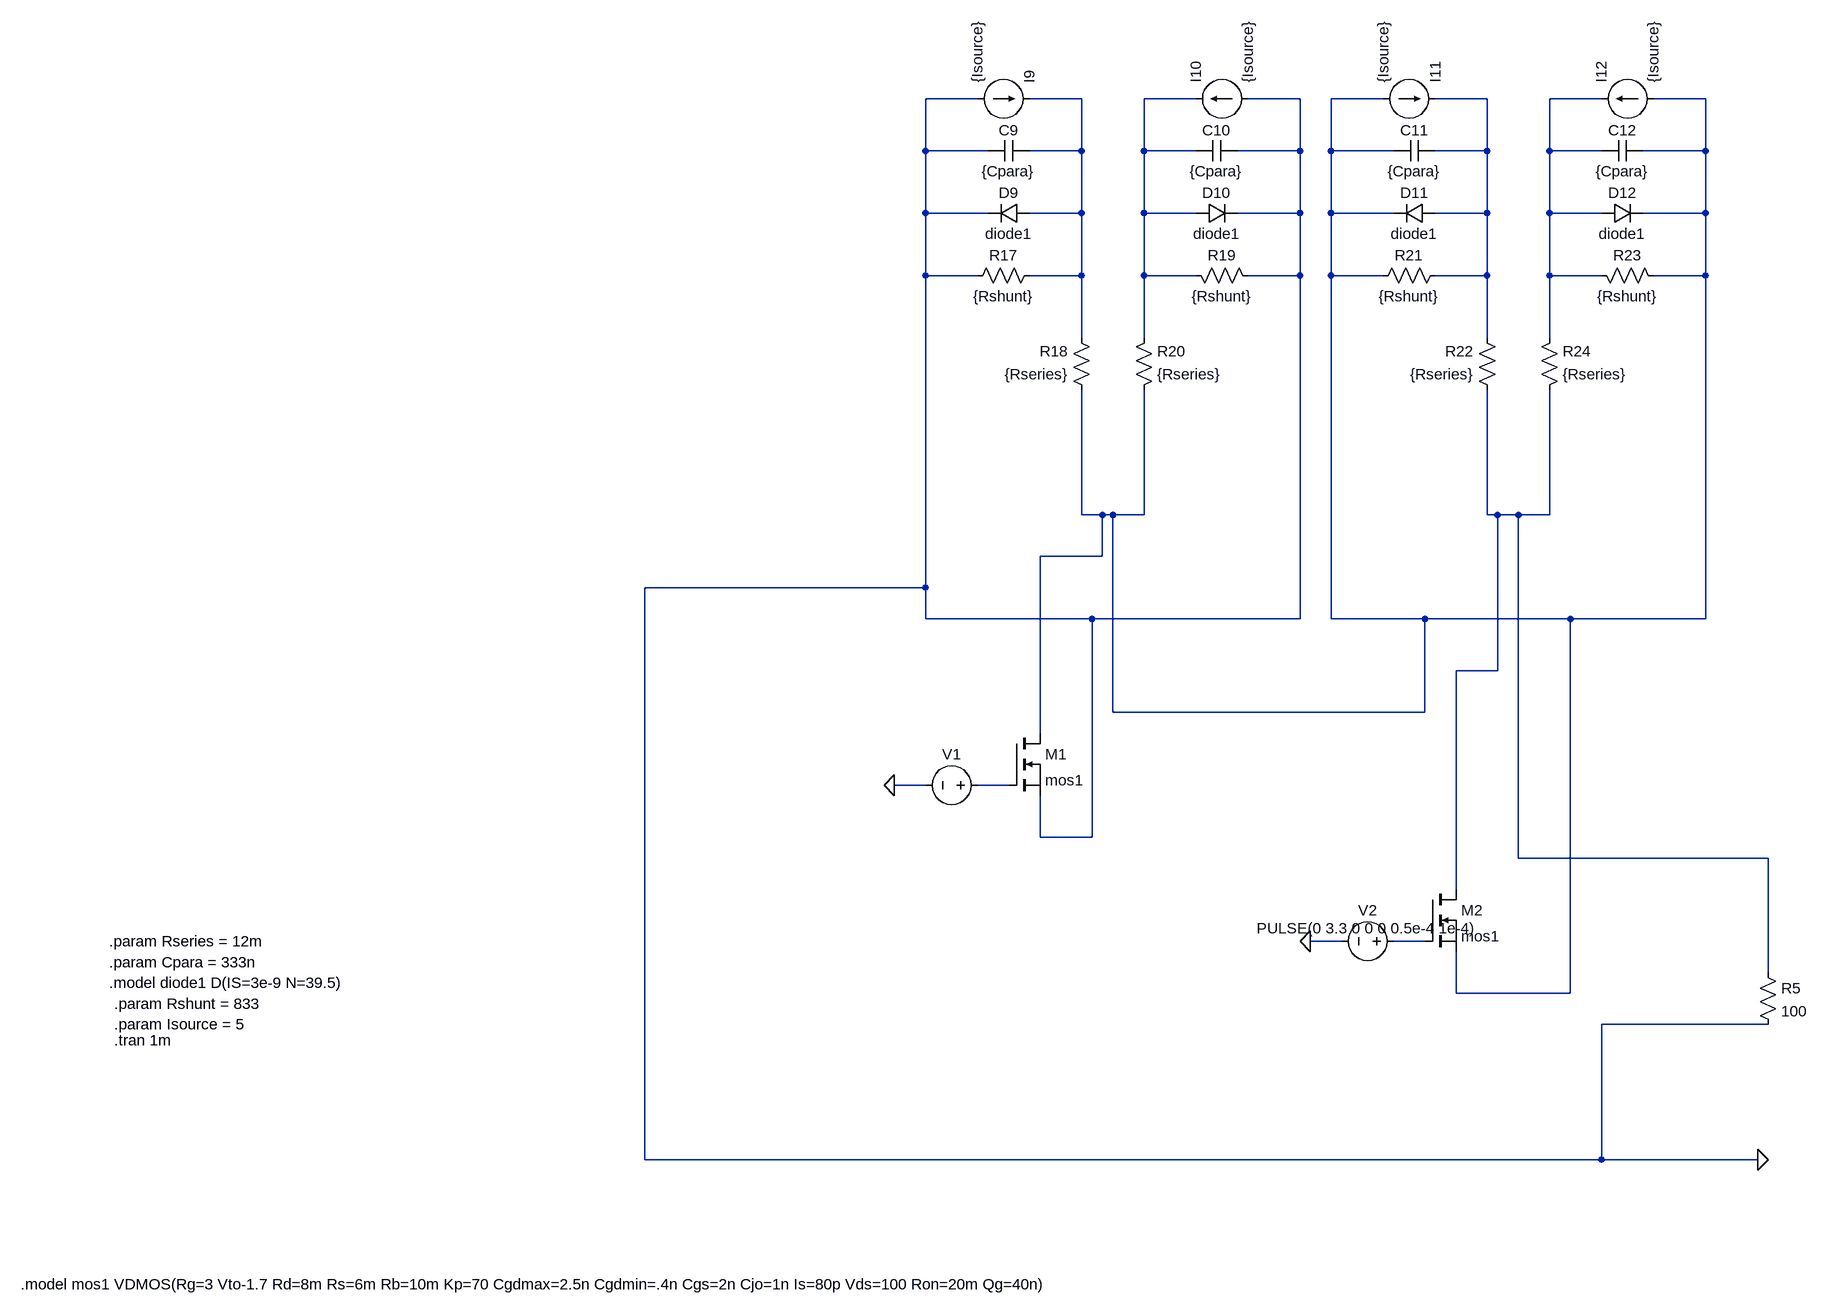
[diagram p0: schematic string-module-simple-36x2.asc]
string-module-simple-36x2.asc, the LTspice schematic file:
Version 4
SHEET 1 5004 680
WIRE 1184 -1504 1104 -1504
WIRE 1344 -1504 1264 -1504
WIRE 1520 -1504 1440 -1504
WIRE 1680 -1504 1600 -1504
WIRE 1808 -1504 1728 -1504
WIRE 1968 -1504 1888 -1504
WIRE 2144 -1504 2064 -1504
WIRE 2304 -1504 2224 -1504
WIRE 1104 -1424 1104 -1504
WIRE 1200 -1424 1104 -1424
WIRE 1344 -1424 1344 -1504
WIRE 1344 -1424 1264 -1424
WIRE 1440 -1424 1440 -1504
WIRE 1520 -1424 1440 -1424
WIRE 1680 -1424 1680 -1504
WIRE 1680 -1424 1584 -1424
WIRE 1728 -1424 1728 -1504
WIRE 1824 -1424 1728 -1424
WIRE 1968 -1424 1968 -1504
WIRE 1968 -1424 1888 -1424
WIRE 2064 -1424 2064 -1504
WIRE 2144 -1424 2064 -1424
WIRE 2304 -1424 2304 -1504
WIRE 2304 -1424 2208 -1424
WIRE 1104 -1328 1104 -1424
WIRE 1200 -1328 1104 -1328
WIRE 1344 -1328 1344 -1424
WIRE 1344 -1328 1264 -1328
WIRE 1440 -1328 1440 -1424
WIRE 1520 -1328 1440 -1328
WIRE 1680 -1328 1680 -1424
WIRE 1680 -1328 1584 -1328
WIRE 1728 -1328 1728 -1424
WIRE 1824 -1328 1728 -1328
WIRE 1968 -1328 1968 -1424
WIRE 1968 -1328 1888 -1328
WIRE 2064 -1328 2064 -1424
WIRE 2144 -1328 2064 -1328
WIRE 2304 -1328 2304 -1424
WIRE 2304 -1328 2208 -1328
WIRE 1104 -1232 1104 -1328
WIRE 1184 -1232 1104 -1232
WIRE 1344 -1232 1344 -1328
WIRE 1344 -1232 1264 -1232
WIRE 1440 -1232 1440 -1328
WIRE 1520 -1232 1440 -1232
WIRE 1680 -1232 1680 -1328
WIRE 1680 -1232 1600 -1232
WIRE 1728 -1232 1728 -1328
WIRE 1808 -1232 1728 -1232
WIRE 1968 -1232 1968 -1328
WIRE 1968 -1232 1888 -1232
WIRE 2064 -1232 2064 -1328
WIRE 2144 -1232 2064 -1232
WIRE 2304 -1232 2304 -1328
WIRE 2304 -1232 2224 -1232
WIRE 1344 -1136 1344 -1232
WIRE 1440 -1136 1440 -1232
WIRE 1968 -1136 1968 -1232
WIRE 2064 -1136 2064 -1232
WIRE 1344 -864 1344 -1056
WIRE 1376 -864 1344 -864
WIRE 1392 -864 1376 -864
WIRE 1440 -864 1440 -1056
WIRE 1440 -864 1392 -864
WIRE 1968 -864 1968 -1056
WIRE 1984 -864 1968 -864
WIRE 2016 -864 1984 -864
WIRE 2064 -864 2064 -1056
WIRE 2064 -864 2016 -864
WIRE 1376 -800 1376 -864
WIRE 1376 -800 1280 -800
WIRE 1104 -752 1104 -1232
WIRE 1104 -752 672 -752
WIRE 1104 -704 1104 -752
WIRE 1360 -704 1104 -704
WIRE 1680 -704 1680 -1232
WIRE 1680 -704 1360 -704
WIRE 1728 -704 1728 -1232
WIRE 1872 -704 1728 -704
WIRE 2096 -704 1872 -704
WIRE 2304 -704 2304 -1232
WIRE 2304 -704 2096 -704
WIRE 1984 -624 1984 -864
WIRE 1984 -624 1920 -624
WIRE 1392 -560 1392 -864
WIRE 1872 -560 1872 -704
WIRE 1872 -560 1392 -560
WIRE 1280 -528 1280 -800
WIRE 1104 -448 1056 -448
WIRE 1232 -448 1184 -448
WIRE 1280 -368 1280 -432
WIRE 1360 -368 1360 -704
WIRE 1360 -368 1280 -368
WIRE 2016 -336 2016 -864
WIRE 2400 -336 2016 -336
WIRE 1920 -288 1920 -624
WIRE 1744 -208 1696 -208
WIRE 1872 -208 1824 -208
WIRE 2400 -160 2400 -336
WIRE 1920 -128 1920 -192
WIRE 2096 -128 2096 -704
WIRE 2096 -128 1920 -128
WIRE 2400 -80 2144 -80
WIRE 672 128 672 -752
WIRE 2144 128 2144 -80
WIRE 2144 128 672 128
WIRE 2384 128 2144 128
FLAG 1056 -448 0
FLAG 2384 128 0
FLAG 1696 -208 0
SYMBOL current 1184 -1504 R270
WINDOW 0 24 80 Left 2
WINDOW 3 24 0 Left 2
WINDOW 123 0 0 Left 2
WINDOW 39 0 0 Left 2
SYMATTR InstName I9
SYMATTR Value {Isource}
SYMBOL cap 1264 -1440 R90
WINDOW 0 0 32 VBottom 2
WINDOW 3 32 32 VTop 2
SYMATTR InstName C9
SYMATTR Value {Cpara}
SYMBOL diode 1264 -1344 R90
WINDOW 0 0 32 VBottom 2
WINDOW 3 32 32 VTop 2
SYMATTR InstName D9
SYMATTR Value diode1
SYMBOL res 1280 -1248 R90
WINDOW 0 0 56 VBottom 2
WINDOW 3 32 56 VTop 2
SYMATTR InstName R17
SYMATTR Value {Rshunt}
SYMBOL res 1360 -1040 R180
WINDOW 0 36 76 Left 2
WINDOW 3 36 40 Left 2
SYMATTR InstName R18
SYMATTR Value {Rseries}
SYMBOL current 1600 -1504 M270
WINDOW 0 24 80 Left 2
WINDOW 3 24 0 Left 2
WINDOW 123 0 0 Left 2
WINDOW 39 0 0 Left 2
SYMATTR InstName I10
SYMATTR Value {Isource}
SYMBOL cap 1520 -1440 M90
WINDOW 0 0 32 VBottom 2
WINDOW 3 32 32 VTop 2
SYMATTR InstName C10
SYMATTR Value {Cpara}
SYMBOL diode 1520 -1344 M90
WINDOW 0 0 32 VBottom 2
WINDOW 3 32 32 VTop 2
SYMATTR InstName D10
SYMATTR Value diode1
SYMBOL res 1504 -1248 M90
WINDOW 0 0 56 VBottom 2
WINDOW 3 32 56 VTop 2
SYMATTR InstName R19
SYMATTR Value {Rshunt}
SYMBOL res 1424 -1040 M180
WINDOW 0 36 76 Left 2
WINDOW 3 36 40 Left 2
SYMATTR InstName R20
SYMATTR Value {Rseries}
SYMBOL current 1808 -1504 R270
WINDOW 0 24 80 Left 2
WINDOW 3 24 0 Left 2
WINDOW 123 0 0 Left 2
WINDOW 39 0 0 Left 2
SYMATTR InstName I11
SYMATTR Value {Isource}
SYMBOL cap 1888 -1440 R90
WINDOW 0 0 32 VBottom 2
WINDOW 3 32 32 VTop 2
SYMATTR InstName C11
SYMATTR Value {Cpara}
SYMBOL diode 1888 -1344 R90
WINDOW 0 0 32 VBottom 2
WINDOW 3 32 32 VTop 2
SYMATTR InstName D11
SYMATTR Value diode1
SYMBOL res 1904 -1248 R90
WINDOW 0 0 56 VBottom 2
WINDOW 3 32 56 VTop 2
SYMATTR InstName R21
SYMATTR Value {Rshunt}
SYMBOL res 1984 -1040 R180
WINDOW 0 36 76 Left 2
WINDOW 3 36 40 Left 2
SYMATTR InstName R22
SYMATTR Value {Rseries}
SYMBOL current 2224 -1504 M270
WINDOW 0 24 80 Left 2
WINDOW 3 24 0 Left 2
WINDOW 123 0 0 Left 2
WINDOW 39 0 0 Left 2
SYMATTR InstName I12
SYMATTR Value {Isource}
SYMBOL cap 2144 -1440 M90
WINDOW 0 0 32 VBottom 2
WINDOW 3 32 32 VTop 2
SYMATTR InstName C12
SYMATTR Value {Cpara}
SYMBOL diode 2144 -1344 M90
WINDOW 0 0 32 VBottom 2
WINDOW 3 32 32 VTop 2
SYMATTR InstName D12
SYMATTR Value diode1
SYMBOL res 2128 -1248 M90
WINDOW 0 0 56 VBottom 2
WINDOW 3 32 56 VTop 2
SYMATTR InstName R23
SYMATTR Value {Rshunt}
SYMBOL res 2048 -1040 M180
WINDOW 0 36 76 Left 2
WINDOW 3 36 40 Left 2
SYMATTR InstName R24
SYMATTR Value {Rseries}
SYMBOL nmos 1232 -528 R0
SYMATTR InstName M1
SYMATTR Value mos1
SYMBOL voltage 1200 -448 R90
WINDOW 0 -32 56 VBottom 2
WINDOW 3 -4 56 VBottom 2
WINDOW 123 -64 56 VBottom 2
WINDOW 39 0 0 Left 2
SYMATTR InstName V1
SYMATTR Value ""
SYMBOL res 2384 -176 R0
SYMATTR InstName R5
SYMATTR Value 100
SYMBOL nmos 1872 -288 R0
SYMATTR InstName M2
SYMATTR Value mos1
SYMBOL voltage 1840 -208 R90
WINDOW 0 -32 56 VBottom 2
WINDOW 3 -4 56 VBottom 2
WINDOW 123 -64 56 VBottom 2
WINDOW 39 0 0 Left 2
SYMATTR InstName V2
SYMATTR Value PULSE(0 3.3 0 0 0 0.5e-4 1e-4)
TEXT -152 -144 Left 2 !.model diode1 D(IS=3e-9 N=39.5)
TEXT -144 -56 Left 2 !.tran 1m
TEXT -144 -112 Left 2 !.param Rshunt = 833
TEXT -152 -208 Left 2 !.param Rseries = 12m
TEXT -152 -176 Left 2 !.param Cpara = 333n
TEXT -144 -80 Left 2 !.param Isource = 5
TEXT -288 320 Left 2 !.model mos1 VDMOS(Rg=3 Vto-1.7 Rd=8m Rs=6m Rb=10m Kp=70 Cgdmax=2.5n Cgdmin=.4n Cgs=2n Cjo=1n Is=80p Vds=100 Ron=20m Qg=40n)

The netlist it stands for:
* string-module-simple-36x2.asc
I9 0 N001 {Isource}
C9 N001 0 {Cpara}
D9 N001 0 diode1
R17 N001 0 {Rshunt}
R18 N003 N001 {Rseries}
I10 0 N002 {Isource}
C10 N002 0 {Cpara}
D10 N002 0 diode1
R19 N002 0 {Rshunt}
R20 N003 N002 {Rseries}
I11 N003 N004 {Isource}
C11 N004 N003 {Cpara}
D11 N004 N003 diode1
R21 N004 N003 {Rshunt}
R22 N006 N004 {Rseries}
I12 N003 N005 {Isource}
C12 N005 N003 {Cpara}
D12 N005 N003 diode1
R23 N005 N003 {Rshunt}
R24 N006 N005 {Rseries}
M1 N003 N007 0 0 mos1
V1 N007 0
R5 N006 0 100
M2 N006 N008 N003 N003 mos1
V2 N008 0 PULSE(0 3.3 0 0 0 0.5e-4 1e-4)
.model D D
.lib standard.dio
.model NMOS NMOS
.model PMOS PMOS
.lib standard.mos
.model diode1 D(IS=3e-9 N=39.5)
.tran 1m
.param Rshunt = 833
.param Rseries = 12m
.param Cpara = 333n
.param Isource = 5
.model mos1 VDMOS(Rg=3 Vto-1.7 Rd=8m Rs=6m Rb=10m Kp=70 Cgdmax=2.5n Cgdmin=.4n Cgs=2n Cjo=1n Is=80p Vds=100 Ron=20m Qg=40n)
.backanno
.end